# EAGLE design IcyHot (EAGLE 9.6.2)
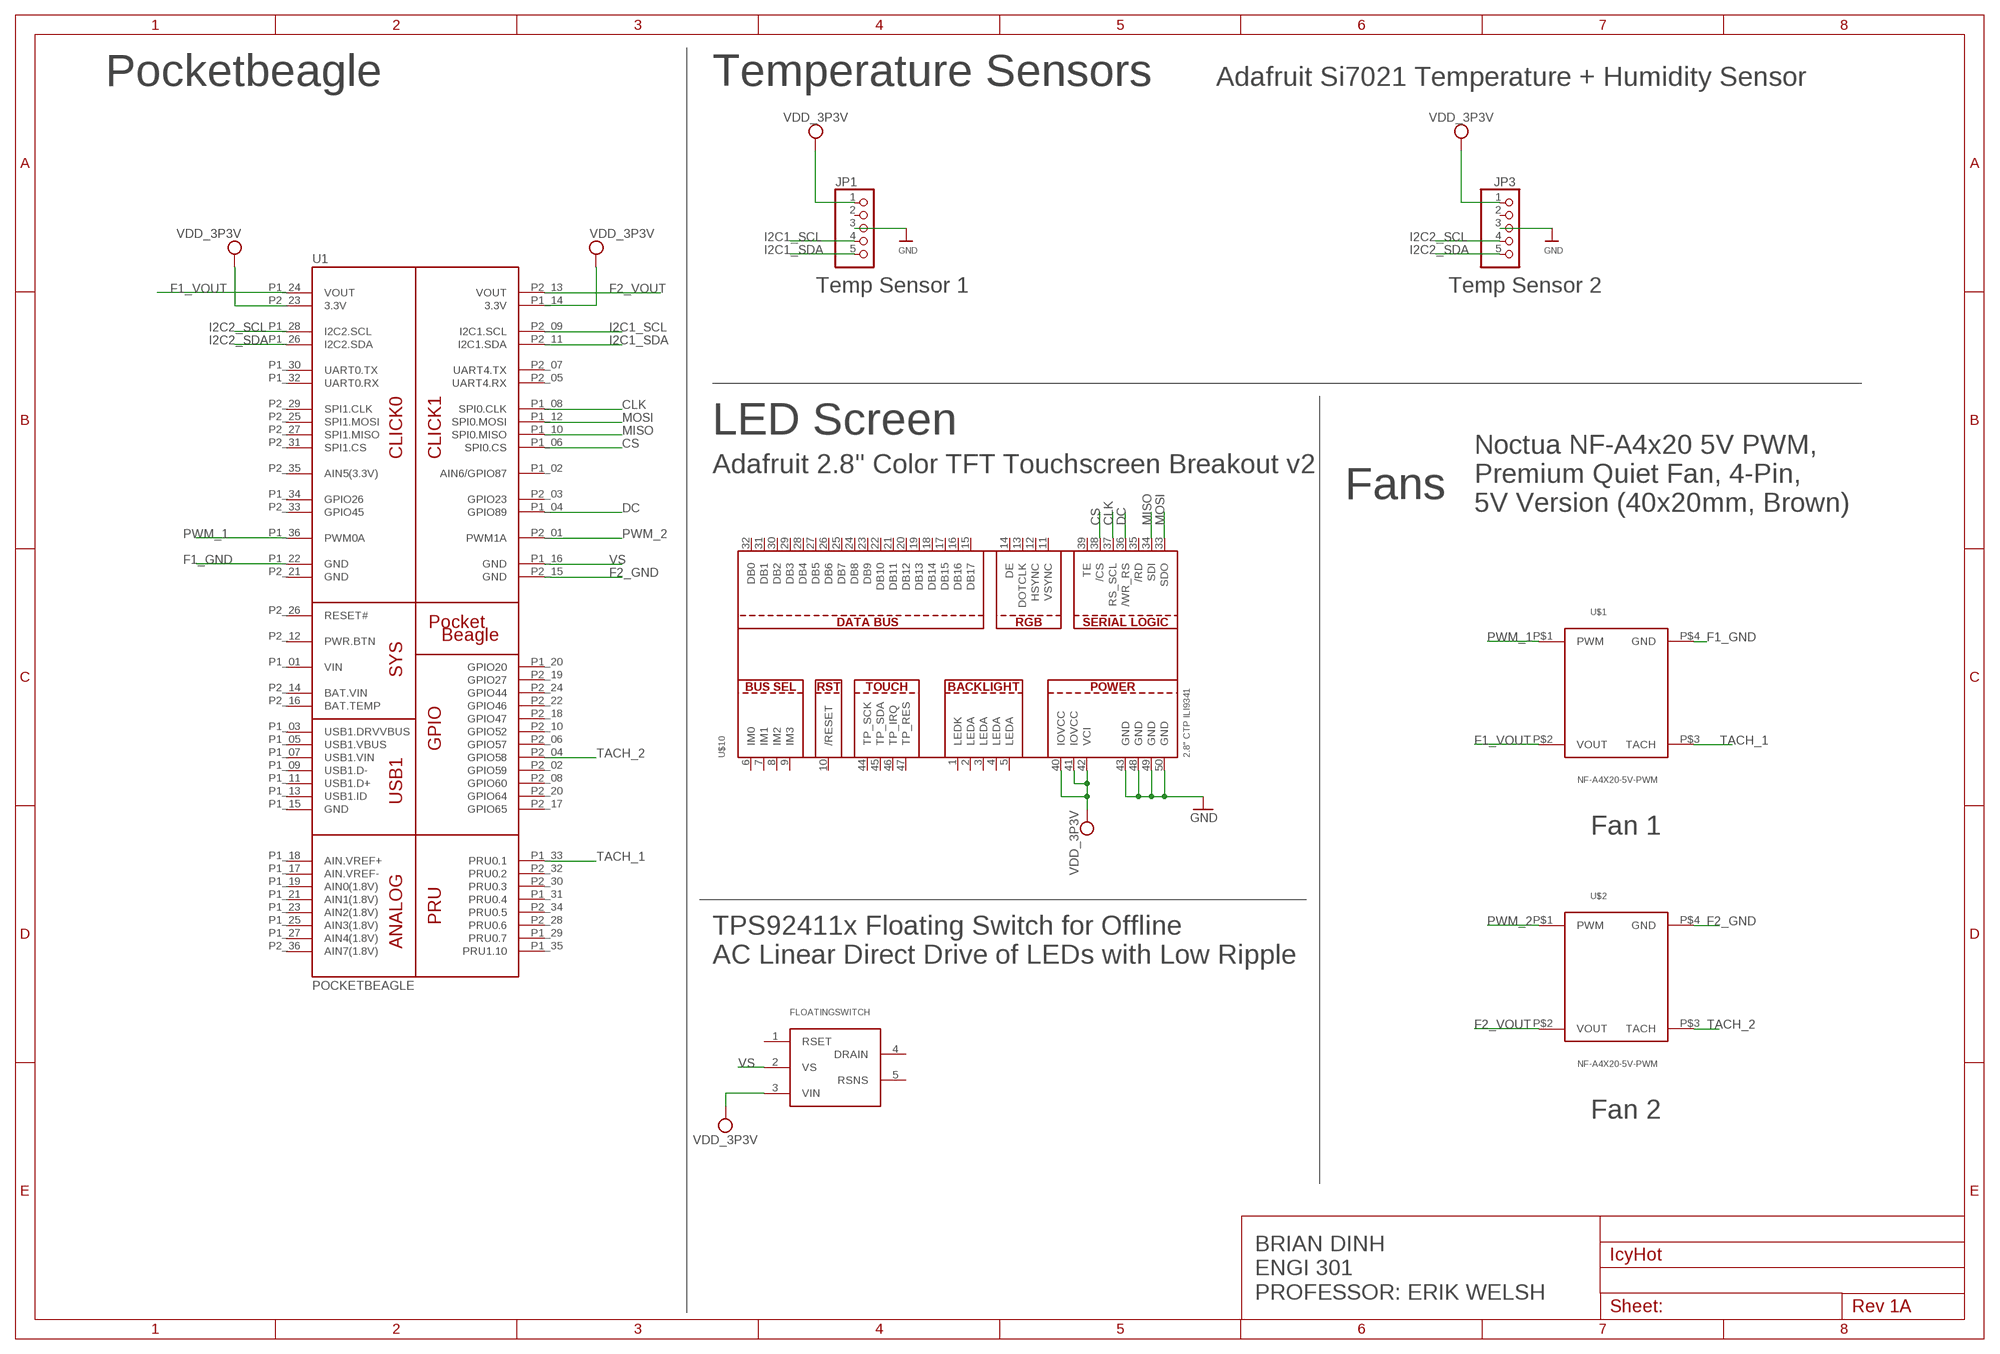
[diagram p0: schematic, sheet 1]

## Parts
FLOATINGSWITCH  TPS92411  [SOT23-5]
JP1  HEADER-1X570MIL  [1X05_ROUND_70]
JP3  HEADER-1X570MIL  [1X05_ROUND_70]
U1  POCKETBEAGLE  [POCKETBEAGLE]
U$1  NF-A4X20-5V-PWM  [NF-A4X20-5V-PWM]
U$2  NF-A4X20-5V-PWM  [NF-A4X20-5V-PWM]
U$10  2.8" CTP ILI9341  DISP_LCD_CTP28_SAMPLE  [TFT_2.83IN_240X320_50PIN]

## Nets
CLK: U1.P1_08(SPI0.CLK) U$10.37(RS_SCL)
CS: U1.P1_06(SPI0.CS) U$10.38(/CS)
DC: U1.P1_04(GPIO89) U$10.36(/WR_RS)
F1_GND: U1.P1_22(GND) U$1.P$4(GND)
F1_VOUT: U1.P1_24(VOUT) U$1.P$2(VOUT)
F2_GND: U1.P2_15(GND) U$2.P$4(GND)
F2_VOUT: U1.P2_13(VOUT) U$2.P$2(VOUT)
GND: JP1.3 JP3.3 U$10.43(GND) U$10.48(GND) U$10.49(GND) U$10.50(GND)
I2C1_SCL: JP1.4 U1.P2_09(I2C1.SCL)
I2C1_SDA: JP1.5 U1.P2_11(I2C1.SDA)
I2C2_SCL: JP3.4 U1.P1_28(I2C2.SCL)
I2C2_SDA: JP3.5 U1.P1_26(I2C2.SDA)
MISO: U1.P1_10(SPI0.MISO) U$10.34(SDI)
MOSI: U1.P1_12(SPI0.MOSI) U$10.33(SDO)
PWM_1: U1.P1_36(PWM0A) U$1.P$1(PWM)
PWM_2: U1.P2_01(PWM1A) U$2.P$1(PWM)
TACH_1: U1.P1_33(PRU0.1) U$1.P$3(TACH)
TACH_2: U1.P2_04(GPIO58) U$2.P$3(TACH)
VDD_3P3V: FLOATINGSWITCH.3(VIN) JP1.1 JP3.1 U1.P1_14(3.3V) U1.P2_23(3.3V) U$10.40(IOVCC) U$10.41(IOVCC) U$10.42(VCI)
VS: FLOATINGSWITCH.2(VS) U1.P1_16(GND)
Unconnected: FLOATINGSWITCH.1(RSET) FLOATINGSWITCH.4(DRAIN) FLOATINGSWITCH.5(RSNS) JP1.2 JP3.2 U1.P1_02(AIN6/GPIO87) U1.P1_03(USB1.DRVVBUS) U1.P1_05(USB1.VBUS) U1.P1_07(USB1.VIN) U1.P1_09(USB1.D-) U1.P1_11(USB1.D+) U1.P1_13(USB1.ID) U1.P1_15(GND) U1.P1_17(AIN.VREF-) U1.P1_18(AIN.VREF+) U1.P1_19(AIN0(1.8V)) U1.P1_20(GPIO20) U1.P1_21(AIN1(1.8V)) U1.P1_23(AIN2(1.8V)) U1.P1_25(AIN3(1.8V)) U1.P1_27(AIN4(1.8V)) U1.P1_29(PRU0.7) U1.P1_30(UART0.TX) U1.P1_31(PRU0.4) U1.P1_32(UART0.RX) U1.P1_34(GPIO26) U1.P1_35(PRU1.10) U1.P2_02(GPIO59) U1.P2_03(GPIO23) U1.P2_05(UART4.RX) U1.P2_06(GPIO57) U1.P2_07(UART4.TX) U1.P2_08(GPIO60) U1.P2_10(GPIO52) U1.P2_12(PWR.BTN) U1.P2_16(BAT.TEMP) U1.P2_17(GPIO65) U1.P2_18(GPIO47) U1.P2_19(GPIO27) U1.P2_20(GPIO64) U1.P2_22(GPIO46) U1.P2_24(GPIO44) U1.P2_25(SPI1.MOSI) U1.P2_26(RESET#) U1.P2_27(SPI1.MISO) U1.P2_28(PRU0.6) U1.P2_29(SPI1.CLK) U1.P2_30(PRU0.3) U1.P2_31(SPI1.CS) U1.P2_32(PRU0.2) U1.P2_33(GPIO45) U1.P2_34(PRU0.5) U1.P2_35(AIN5(3.3V)) U1.P2_36(AIN7(1.8V)) U$10.1(LEDK) U$10.2(LEDA) U$10.3(LEDA) U$10.4(LEDA) U$10.5(LEDA) U$10.6(IM0) U$10.7(IM1) U$10.8(IM2) U$10.9(IM3) U$10.10(/RESET) U$10.11(VSYNC) U$10.12(HSYNC) U$10.13(DOTCLK) U$10.14(DE) U$10.15(DB17) U$10.16(DB16) U$10.17(DB15) U$10.18(DB14) U$10.19(DB13) U$10.20(DB12) U$10.21(DB11) U$10.22(DB10) U$10.23(DB9) U$10.24(DB8) U$10.25(DB7) U$10.26(DB6) U$10.27(DB5) U$10.28(DB4) U$10.29(DB3) U$10.30(DB2) U$10.31(DB1) U$10.32(DB0) U$10.35(/RD) U$10.39(TE) U$10.44(TP_SCK) U$10.45(TP_SDA) U$10.46(TP_IRQ) U$10.47(TP_RES)

## Notes on the sheet
- Pocketbeagle | Temperature Sensors | Adafruit Si7021 Temperature + Humidity Sensor
- Temp Sensor 1 | Temp Sensor 2
- LED Screen
- Adafruit 2.8" Color TFT Touchscreen Breakout v2
- Fans
- Noctua NF-A4x20 5V PWM,
  Premium Quiet Fan, 4-Pin, 
  5V Version (40x20mm, Brown)
- Fan 1
- TPS92411x Floating Switch for Offline 
  AC Linear Direct Drive of LEDs with Low Ripple
- Fan 2
- BRIAN DINH
  ENGI 301
  PROFESSOR: ERIK WELSH

## Power pins joined to a net without a drawn wire
BAT.VIN: U1.P2_14(BAT.VIN)
GND: U1.P2_21(GND)
VIN: U1.P1_01(VIN)

## Library data of the parts
FLOATINGSWITCH = IcyHot:TPS92411: TPS92411x Floating Switch for Offline AC Linear Direct Drive of LEDs with Low Ripple Current For ENGI 301 project
JP1 JP3 = microbuilder:HEADER-1X5: PIN HEADER
U1 = ENGI301:POCKETBEAGLE
U$1 U$2 = IcyHot:NF-A4X20-5V-PWM: Noctua Fan (fan for system) NF-A4x20 5V PWM
U$10 = microbuilder:DISP_LCD_CTP28: 2.83" 240x320 Pixel Capacitive Touch Display

## Net classes
1 highpower: width 0.305 mm, drill 0.483 mm
2 lowpower: width 0.254 mm, drill 0.483 mm

## Board
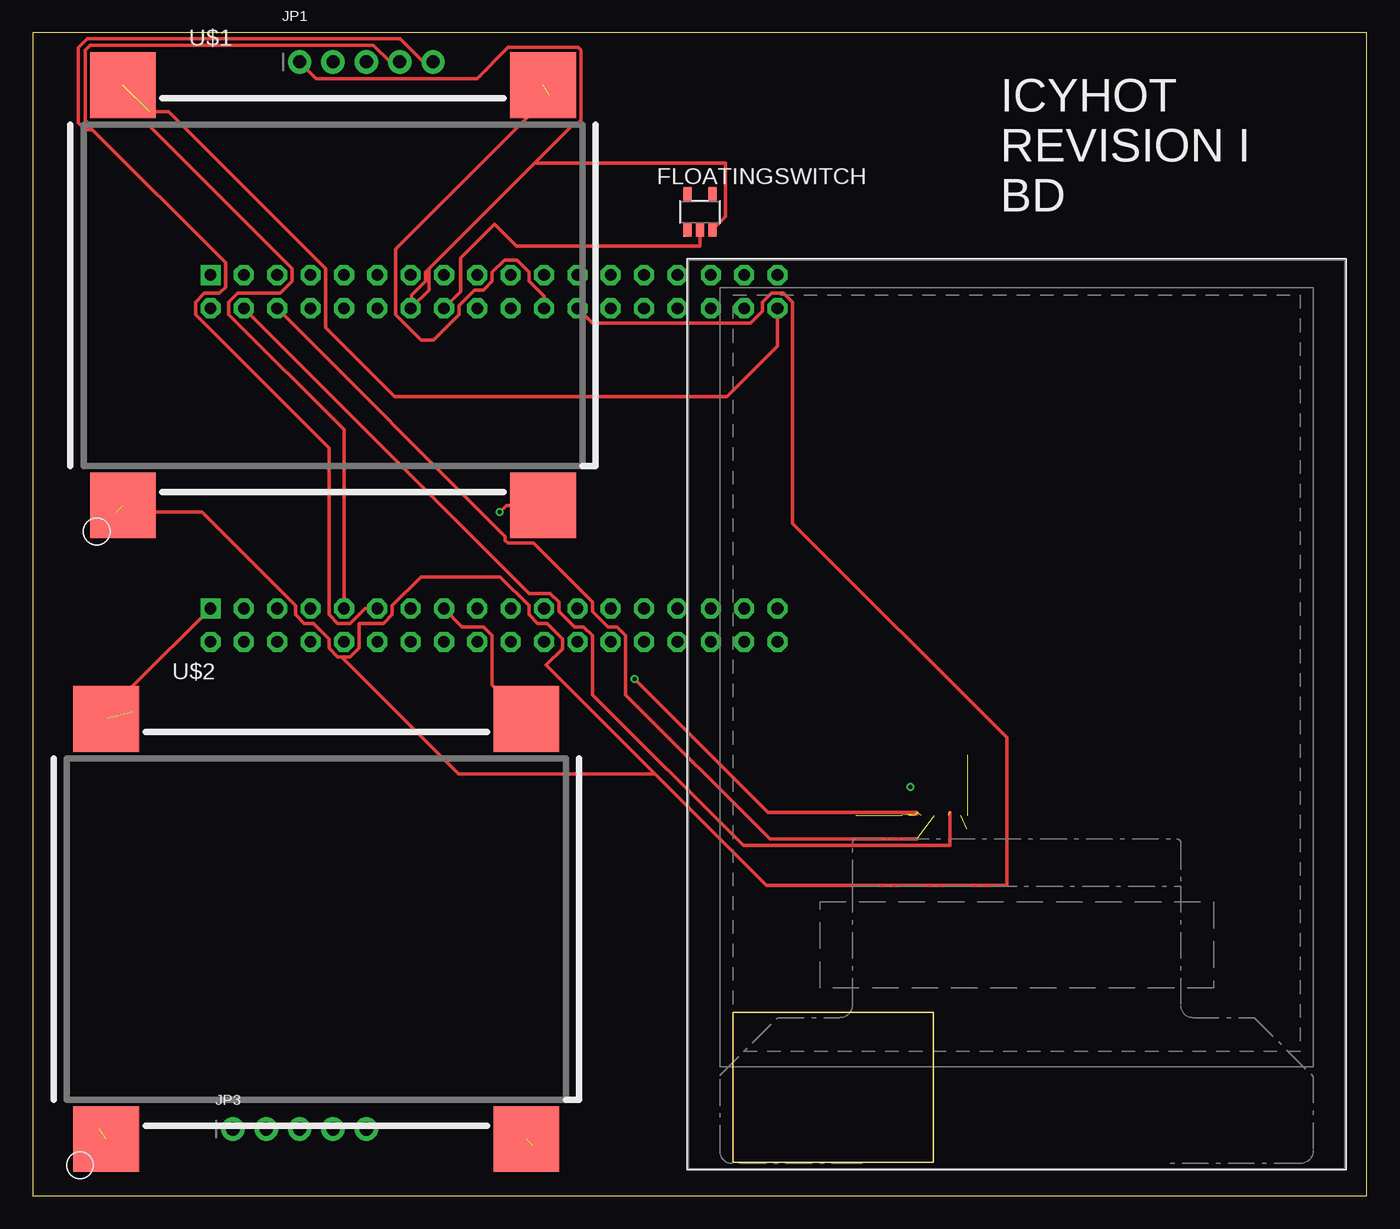
[diagram p1: board, top side]
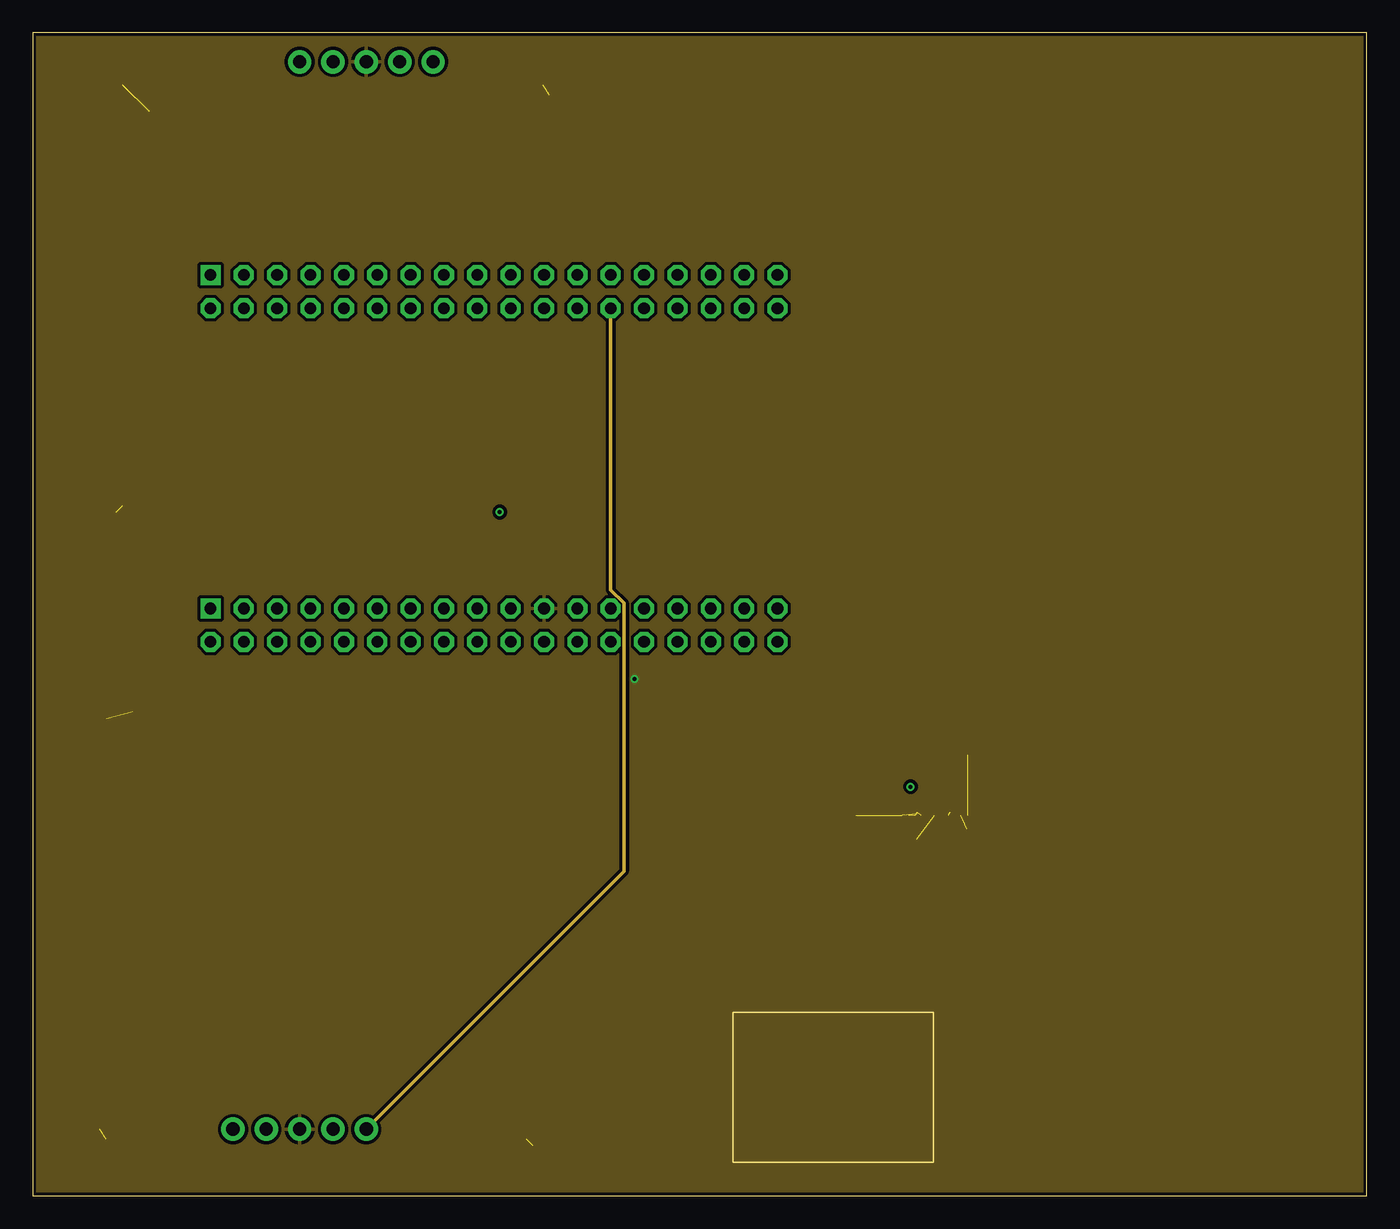
[diagram p2: board, inner layer Route2]
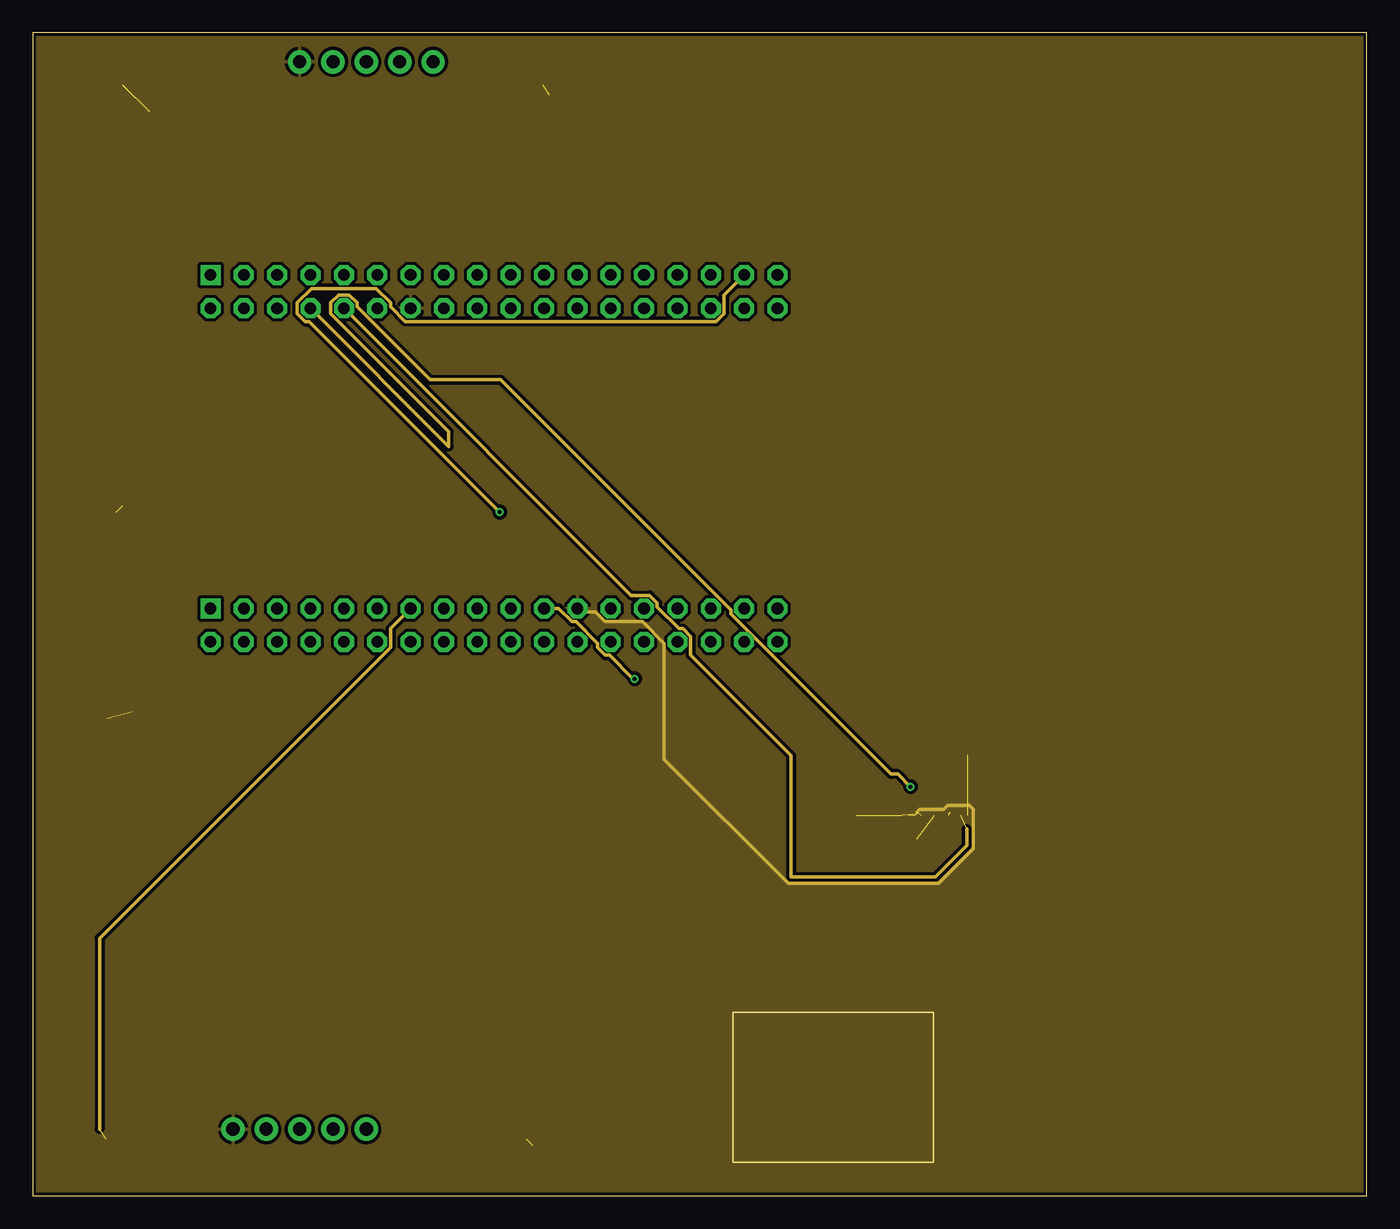
[diagram p3: board, inner layer Route15]
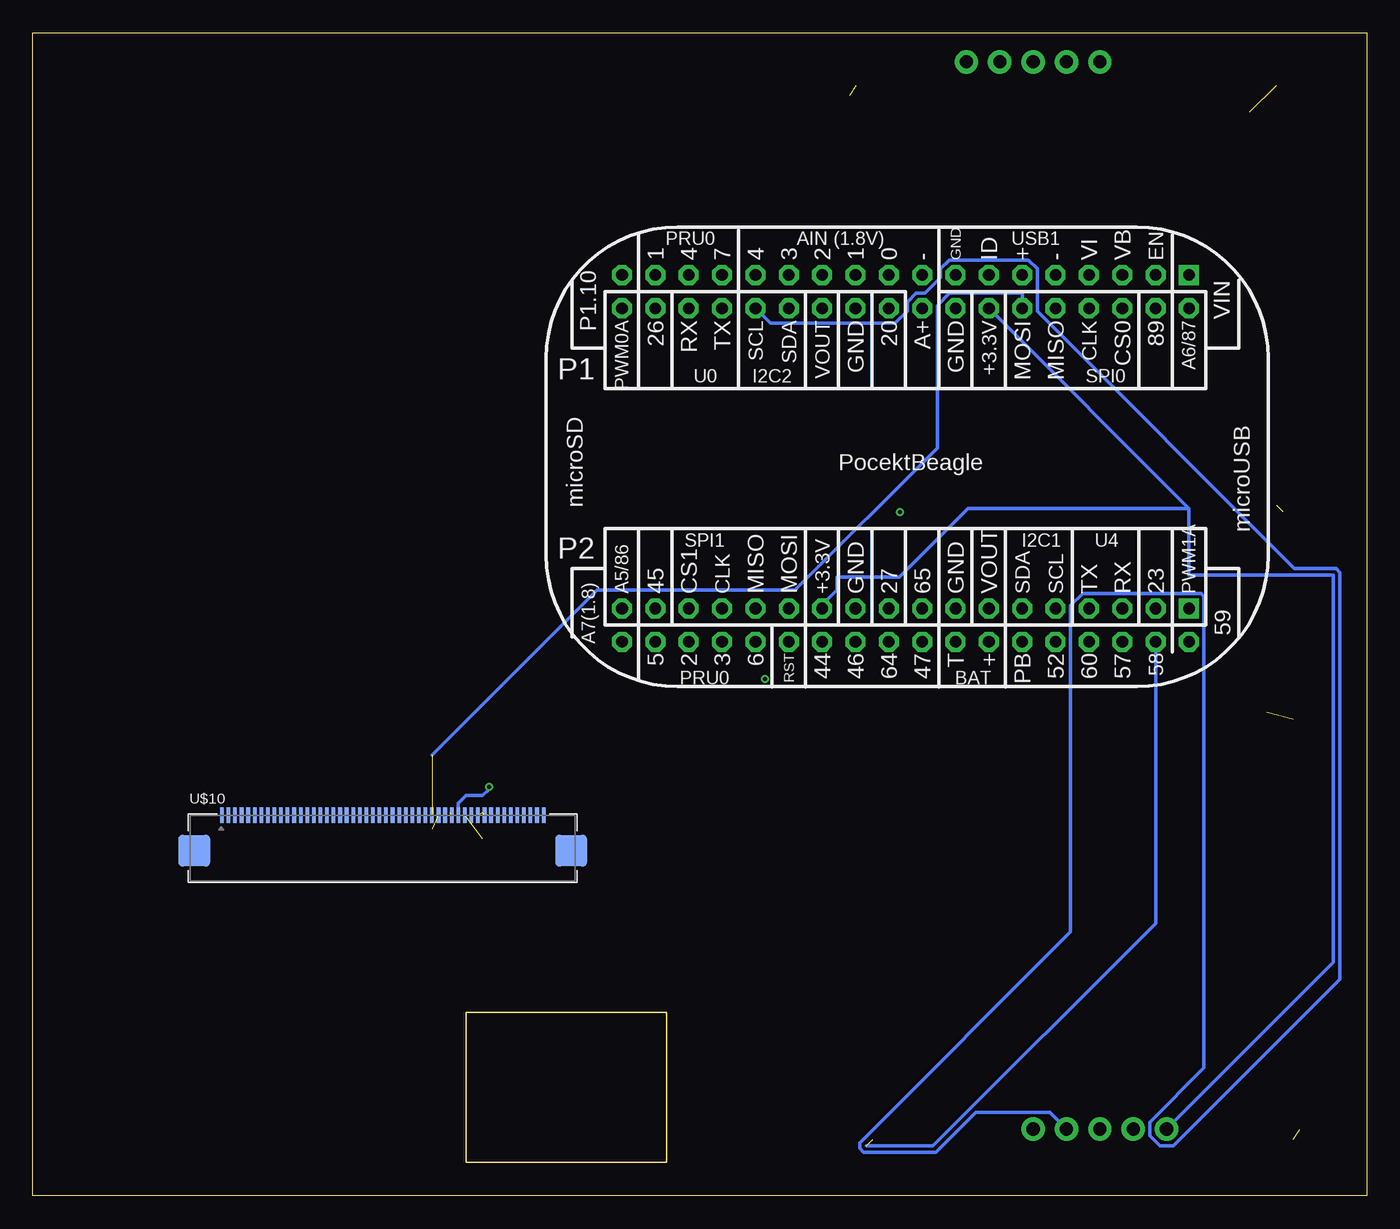
[diagram p4: board, bottom side, seen from below]

Size 101.58 x 88.57 mm. Coordinates in mm from the lower left corner, seen from the top.
Outline: 0,0 101.58,0 101.58,88.57 0,88.57 0,0
Copper layers (1*2*15*16): Top 0.035mm / dielectric 0.23mm / Route2 0.035mm / dielectric 0.93mm / Route15 0.035mm / dielectric 0.23mm / Bottom 0.035mm
Design rules "ENGI301_4lyr": minimum track width 10mil, minimum drill 12mil, track to track 10mil, track to pad 10mil, pad to pad 10mil, via to via 10mil, smd to smd 10mil, copper to edge 10mil, drill to drill 12mil, minimum pad ring 6mil, minimum via ring 6mil, stop-mask expansion 3mil, vias tented up to drill 25mil, thermal gap 10mil

### Footprints (pad centres in the part's own frame; a part is rotated, then mirrored left to right if it is on the bottom)
SOT23-5 = smd 0.6 x 1.05: 1 -0.95,-1.35; 2 0,-1.35; 3 0.95,-1.35; 4 0.95,1.35; 5 -0.95,1.35
1X05_ROUND_70 = drill 1 pad 1.778: 1 -5.08,0; 2 -2.54,0; 3 0,0; 4 2.54,0; 5 5.08,0
POCKETBEAGLE = drill 0.889 pad 1.524 square: P1_01 5.91,3.53; P2_01 5.91,28.93 | drill 0.889 pad 1.524 octagon: P1_02 5.91,6.07; P1_03 8.45,3.53; P1_04 8.45,6.07; P1_05 10.99,3.53; P1_06 10.99,6.07; P1_07 13.53,3.53; P1_08 13.53,6.07; P1_09 16.07,3.53; P1_10 16.07,6.07; P1_11 18.61,3.53; P1_12 18.61,6.07; P1_13 21.15,3.53; P1_14 21.15,6.07; P1_15 23.69,3.53; P1_16 23.69,6.07; P1_17 26.23,3.53; P1_18 26.23,6.07; P1_19 28.77,3.53; P1_20 28.77,6.07; P1_21 31.31,3.53; P1_22 31.31,6.07; P1_23 33.85,3.53; P1_24 33.85,6.07; P1_25 36.39,3.53; P1_26 36.39,6.07; P1_27 38.93,3.53; P1_28 38.93,6.07; P1_29 41.47,3.53; P1_30 41.47,6.07; P1_31 44.01,3.53; P1_32 44.01,6.07; P1_33 46.55,3.53; P1_34 46.55,6.07; P1_35 49.09,3.53; P1_36 49.09,6.07; P2_02 5.91,31.47; P2_03 8.45,28.93; P2_04 8.45,31.47; P2_05 10.99,28.93; P2_06 10.99,31.47; P2_07 13.53,28.93; P2_08 13.53,31.47; P2_09 16.07,28.93; P2_10 16.07,31.47; P2_11 18.61,28.93; P2_12 18.61,31.47; P2_13 21.15,28.93; P2_14 21.15,31.47; P2_15 23.69,28.93; P2_16 23.69,31.47; P2_17 26.23,28.93; P2_18 26.23,31.47; P2_19 28.77,28.93; P2_20 28.77,31.47; P2_21 31.31,28.93; P2_22 31.31,31.47; P2_23 33.85,28.93; P2_24 33.85,31.47; P2_25 36.39,28.93; P2_26 36.39,31.47; P2_27 38.93,28.93; P2_28 38.93,31.47; P2_29 41.47,28.93; P2_30 41.47,31.47; P2_31 44.01,28.93; P2_32 44.01,31.47; P2_33 46.55,28.93; P2_34 46.55,31.47; P2_35 49.09,28.93; P2_36 49.09,31.47
NF-A4X20-5V-PWM = smd 5 x 5: P$1 -16,16; P$2 -16,-16; P$3 16,-16; P$4 16,16
TFT_2.83IN_240X320_50PIN = smd 0.275 x 1.2 bottom: 1 12.25,-10.39; 2 11.75,-10.39; 3 11.25,-10.39; 4 10.75,-10.39; 5 10.25,-10.39; 6 9.75,-10.39; 7 9.25,-10.39; 8 8.75,-10.39; 9 8.25,-10.39; 10 7.75,-10.39; 11 7.25,-10.39; 12 6.75,-10.39; 13 6.25,-10.39; 14 5.75,-10.39; 15 5.25,-10.39; 16 4.75,-10.39; 17 4.25,-10.39; 18 3.75,-10.39; 19 3.25,-10.39; 20 2.75,-10.39; 21 2.25,-10.39; 22 1.75,-10.39; 23 1.25,-10.39; 24 0.75,-10.39; 25 0.25,-10.39; 26 -0.25,-10.39; 27 -0.75,-10.39; 28 -1.25,-10.39; 29 -1.75,-10.39; 30 -2.25,-10.39; 31 -2.75,-10.39; 32 -3.25,-10.39; 33 -3.75,-10.39; 34 -4.25,-10.39; 35 -4.75,-10.39; 36 -5.25,-10.39; 37 -5.75,-10.39; 38 -6.25,-10.39; 39 -6.75,-10.39; 40 -7.25,-10.39; 41 -7.75,-10.39; 42 -8.25,-10.39; 43 -8.75,-10.39; 44 -9.25,-10.39; 45 -9.75,-10.39; 46 -10.25,-10.39; 47 -10.75,-10.39; 48 -11.25,-10.39; 49 -11.75,-10.39; 50 -12.25,-10.39 | smd 2.4 x 2.4 bottom: PAD1 14.35,-13.09; PAD2 -14.35,-13.09

### Placement (x,y rotation side)
FLOATINGSWITCH  50.8,74.93 0 top
JP1  25.4,86.36 0 top
JP3  20.32,5.08 0 top
U1  7.62,73.66 180 bottom
U$1  22.86,68.58 0 top
U$2  21.59,20.32 0 top
U$10  74.93,39.37 0 top

### Tracks (layer width: path | path; a pad name or v marks a point on that pad's centre or on a via)
CLK  (via drill 0.3 pad 0.61)
  Route15 0.254: U1.P1_08 31.67,57.07 31.67,58.19 22.69,67.17 22.69,68.01 23.27,68.59 24.11,68.59 24.69,68.01 24.69,67.71 30.25,62.15 35.63,62.15 53.17,44.61 53.17,44.31 65.36,32.12 65.87,32.12 v66.84,31.15
  Bottom 0.254: U$10.37 69.18,29.88 68.58,30.48 67.31,30.48 66.84,30.95 v66.84,31.15
CS  (1 unrouted)
  Top 0.254: U1.P1_06 35.98,50.22 35.98,49.92 36.2,49.7 38.12,49.7 42.61,45.2 42.61,44.51 43.79,43.33 44.48,43.33 45.15,42.66 45.15,38.16 56.14,27.18 67.31,27.18
DC  (1 unrouted)
  Top 0.254: U1.P1_04 37.79,45.87 39.4,45.87 40.07,45.2 40.07,44.51 41.25,43.33 41.94,43.33 42.61,42.66 42.61,38.16 54.1,26.67 69.85,26.67 69.85,29.21
F1_GND  (1 unrouted)
  Top 0.254: U1.P1_22 38.93,68.51 37.79,69.66 37.79,70.35 36.86,71.27 35.92,71.27 34.99,70.35 34.99,69.66 34.32,68.99 33.63,68.99 32.45,67.81 32.45,67.12 30.51,65.18 29.57,65.18 27.63,67.12 27.63,72.08 39.37,83.82
F1_VOUT  (1 unrouted)
  Top 0.254: 6.35,52.07 8.89,52.07 12.89,52.07 20.01,44.95 20.01,44.26 20.68,43.59 21.37,43.59 22.55,42.41 22.55,41.72 23.22,41.05 23.51,41.05 | 47.37,32.13 55.88,23.62 74.17,23.62 74.17,34.89 57.85,51.21 57.85,68.06 57.18,68.73 56.24,68.73 55.57,68.06 55.57,67.37 54.64,66.45 42.61,66.45 U1.P1_24 | 47.37,32.13 39.09,40.41 40.33,41.65 40.33,42.41 39.15,43.59 38.46,43.59 37.79,44.26 37.79,44.95 35.59,47.14 29.57,47.14 27.37,44.95 27.37,44.26 26.7,43.59 24.83,43.59 24.83,41.72 24.16,41.05 23.51,41.05 | 47.37,32.13 32.43,32.13 30.38,34.19 29.91,34.65 23.51,41.05
F2_GND
  Top 0.254: U$2.P$4 34.99,38.92 34.99,42.66 34.32,43.33 32.71,43.33 U1.P2_15
F2_VOUT  (1 unrouted)
  Route15 0.254: U1.P2_13 27.23,43.19 27.23,41.77 5.08,19.62 5.08,5.08
GND  (via drill 0.3 pad 0.61)  (4 unrouted)
  Top 0.254: v45.84,39.37 56,29.21 67.31,29.21 67.31,29.08
  Route15 0.254: U1.P2_21 40.05,44.73 41.05,43.73 41.35,43.73 43.01,42.07 43.01,41.77 43.59,41.19 43.9,41.19 45.72,39.37 v45.84,39.37
  Bottom 0.254: 39.37,44.45 39.37,44.29 U1.P2_21
  pour Route2: -2.54,91.44 -2.54,-2.54 104.14,-2.54 104.14,91.44
I2C1_SCL
  Top 0.254: JP1.4 27.2,86.36 25.93,87.63 4.37,87.63 3.98,87.24 3.98,81.92 4.2,81.7 8.66,81.7 19.75,70.6 19.75,69.66 18.83,68.73 15.6,68.73 14.93,68.06 14.93,67.12 23.69,58.35 U1.P2_09
I2C1_SDA
  Top 0.254: JP1.5 29.74,86.36 27.96,88.14 4.16,88.14 3.47,87.45 3.47,81.71 3.99,81.19 4.53,81.19 14.67,71.05 14.67,69.21 14.2,68.73 13.06,68.73 12.39,68.06 12.39,67.12 22.55,56.96 22.55,44.26 23.22,43.59 24.16,43.59 25.31,44.73 U1.P2_11
I2C2_SCL
  Bottom 0.254: JP3.4 24.13,6.35 29.76,6.35 32.81,3.3 38.31,3.3 38.61,3.6 38.61,4.02 22.55,20.08 22.55,44.95 21.62,45.87 12.61,45.87 12.39,45.65 12.39,9.73 16.51,5.61 16.51,4.55 15.77,3.81 14.71,3.81 2.03,16.49 2.03,47.48 2.33,47.78 5.49,47.78 25.09,67.37 25.09,70.6 25.76,71.27 31.78,71.27 32.45,70.6 32.45,69.91 33.63,68.73 34.32,68.73 34.99,68.06 34.99,67.37 35.92,66.45 45.41,66.45 U1.P1_28
I2C2_SDA
  Route2 0.254: U1.P1_26 44.01,46.15 45.01,45.15 45.01,24.69 JP3.5
MISO  (1 unrouted)
  Route15 0.254: 71.12,27.94 71.12,26.67 68.74,24.29 57.75,24.29 57.75,33.02 57.75,33.38 57.75,33.53 50.09,41.19 50.09,42.61 49.51,43.19 49.21,43.19 47.55,44.85 47.55,45.15 46.97,45.73 45.55,45.73 U1.P1_10
MOSI  (1 unrouted)
  Bottom 0.254: 71.18,33.57 58.62,46.13 43.54,46.13 32.71,56.96 32.71,67.81 31.78,68.73 26.23,68.73 U1.P1_12
PWM_1  (1 unrouted)
  Top 0.254: U1.P1_36 56.71,64.7 52.87,60.86 27.54,60.86 22.29,66.1 22.29,70.6 10.35,82.55 8.89,82.55
PWM_2  (1 unrouted)
  Top 0.254: U1.P2_01 7.62,38.82 7.62,36.83
TACH_1  (via drill 0.3 pad 0.61)
  Top 0.254: v35.56,52.07 36.07,52.58 U$1.P$3
  Route15 0.254: U1.P1_33 52.63,68.59 52.63,67.17 52.05,66.59 28.35,66.59 27.23,67.71 27.23,68.01 26.14,69.1 21.24,69.1 20.15,68.01 20.15,67.17 20.73,66.59 21.04,66.59 v35.56,52.07
TACH_2  (1 unrouted)
  Bottom 0.254: U1.P2_04 16.07,20.76 33.02,3.81 38.1,3.81
VDD_3P3V  (3 unrouted)
  Top 0.254: U1.P1_14 28.85,67.67 | 28.85,67.67 30.17,68.99 30.17,70.6 38.22,78.66 52.75,78.66 52.75,74.58 FLOATINGSWITCH.3 | 28.85,67.67 28.85,68.59 29.91,69.66 29.91,70.35 41.26,81.7 41.52,81.7 41.74,81.92 41.74,87.24 41.52,87.46 36.2,87.46 33.83,85.09 21.59,85.09 JP1.1
  Route15 0.254: U1.P2_23 41.75,44.45 42.87,44.45 43.59,43.73 46.43,43.73 48.09,42.07 48.09,33.24 57.54,23.78 68.95,23.78 71.63,26.46 71.63,29.42 71.33,29.72 69.64,29.72 69.34,29.42 67.52,29.42 67.31,29.21
  Bottom 0.254: JP3.1 2.54,17.78 2.54,47.27 13.53,47.27 13.53,52.35 | U1.P1_14 13.53,52.35 | 13.53,52.35 30.39,52.35 35.59,47.14 40.33,47.14 40.33,46.13 41.47,44.98 U1.P2_23
  pour Route15 (rank 6): -5.08,93.98 -5.08,-6.35 106.68,-6.35 106.68,93.98
VS
  Top 0.254: FLOATINGSWITCH.2 50.8,72.31 36.83,72.31 35.16,73.98 32.58,71.4 32.58,68.86 U1.P1_16

### Text on the board
tNames: ICYHOT / REVISION I / BD